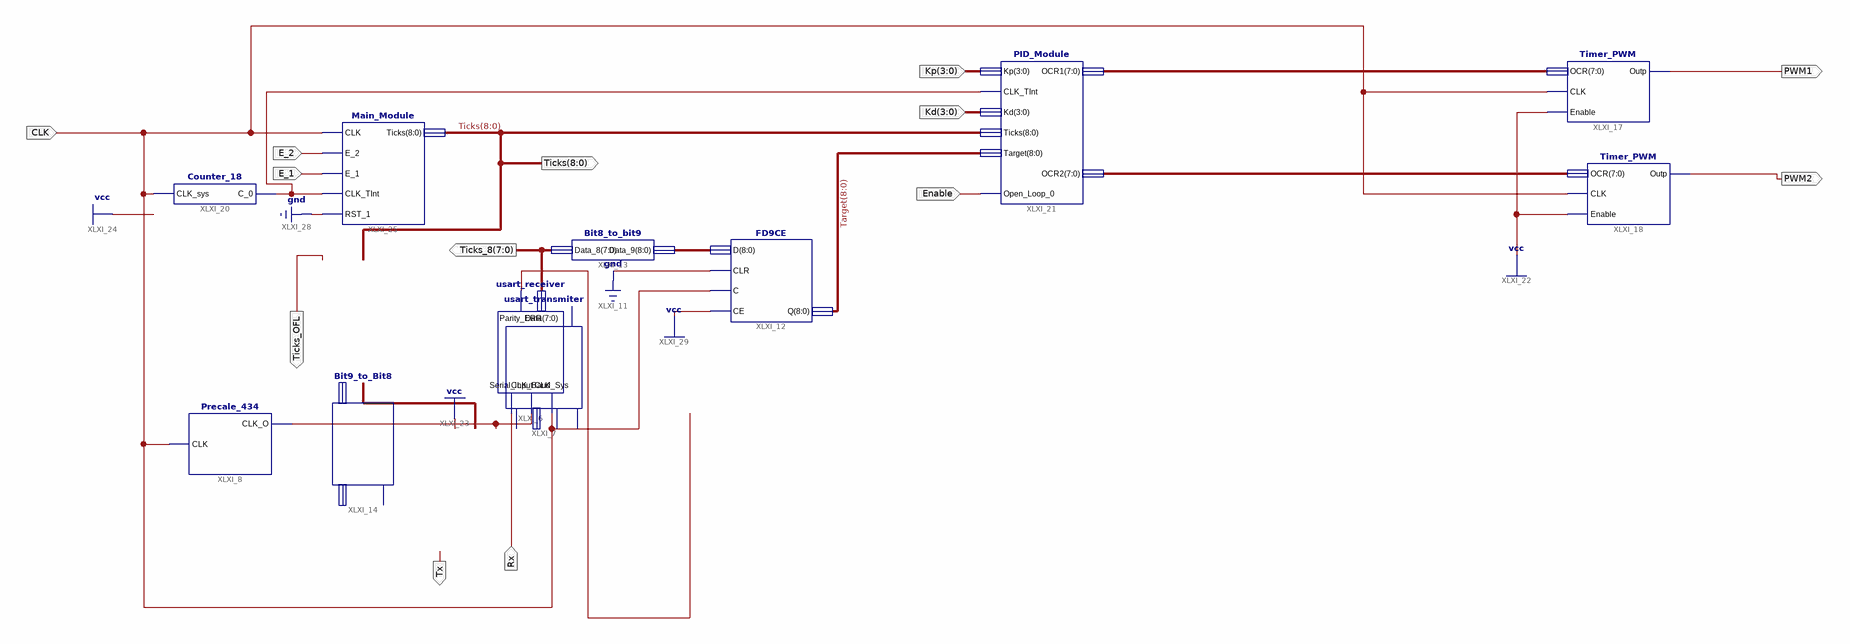
[diagram p0: schematic sheet 1]
// Xilinx ISE schematic ETC_PWM_USART.sch (spartan3e) as structural Verilog: 11 symbols, 13 ports
module ETC_PWM_USART (
  input  E_2,
  input  E_1,
  input  CLK,
  input  Rx,
  input  [3:0] Kp,
  input  [3:0] Kd,
  input  Enable,
  output [8:0] Ticks,
  output Ticks_OFL,
  output Tx,
  output PWM1,
  output PWM2,
  output [7:0] Ticks_8
);

  wire XLXN_15, XLXN_23, XLXN_127;
  wire [7:0] Ticks_counted_8, XLXN_54, XLXN_55;
  wire [8:0] Target, XLXN_39;

  usart_receiver XLXI_6 (.CLK_Baud(XLXN_15), .Serial_input(Rx), .CLK_Sys(CLK), .Parity_ERR(XLXN_23), .Data(Ticks_8));
  Precale_434 XLXI_8 (.CLK(CLK), .CLK_O(XLXN_15));
  FD9CE XLXI_12 (.CE(1'b1), .CLR(1'b0), .D(XLXN_39), .Q(Target), .C(CLK));
  Bit8_to_bit9 XLXI_13 (.Data_8(Ticks_8), .Data_9(XLXN_39));
  Bit9_to_Bit8 XLXI_14 (.Data_9(Ticks), .Data_8(Ticks_counted_8), .OFL(Ticks_OFL));
  usart_transmiter XLXI_7 (.OUT_ser(Tx), .Enable(1'b1), .CLK_Baud(XLXN_15), .Data(Ticks_counted_8));  // open: CLR
  Counter_18 XLXI_20 (.CLK_sys(CLK), .C_0(XLXN_127));
  Timer_PWM XLXI_17 (.OCR(XLXN_54), .CLK(CLK), .Enable(1'b1), .Outp(PWM1));
  Timer_PWM XLXI_18 (.OCR(XLXN_55), .CLK(CLK), .Enable(1'b1), .Outp(PWM2));
  PID_Module XLXI_21 (
    .Kp(Kp), .CLK_TInt(XLXN_127), .Kd(Kd), .Ticks(Ticks), .Target(Target), .Open_Loop_0(Enable),
    .OCR1(XLXN_54), .OCR2(XLXN_55));
  Main_Module XLXI_25 (.CLK(CLK), .E_2(E_2), .E_1(E_1), .Ticks(Ticks), .CLK_TInt(XLXN_127), .RST_1(1'b0));
endmodule
